# Altium schematic sheet POWER.SchDoc
size A2; SheetNumber: 2; SheetTotal: 8
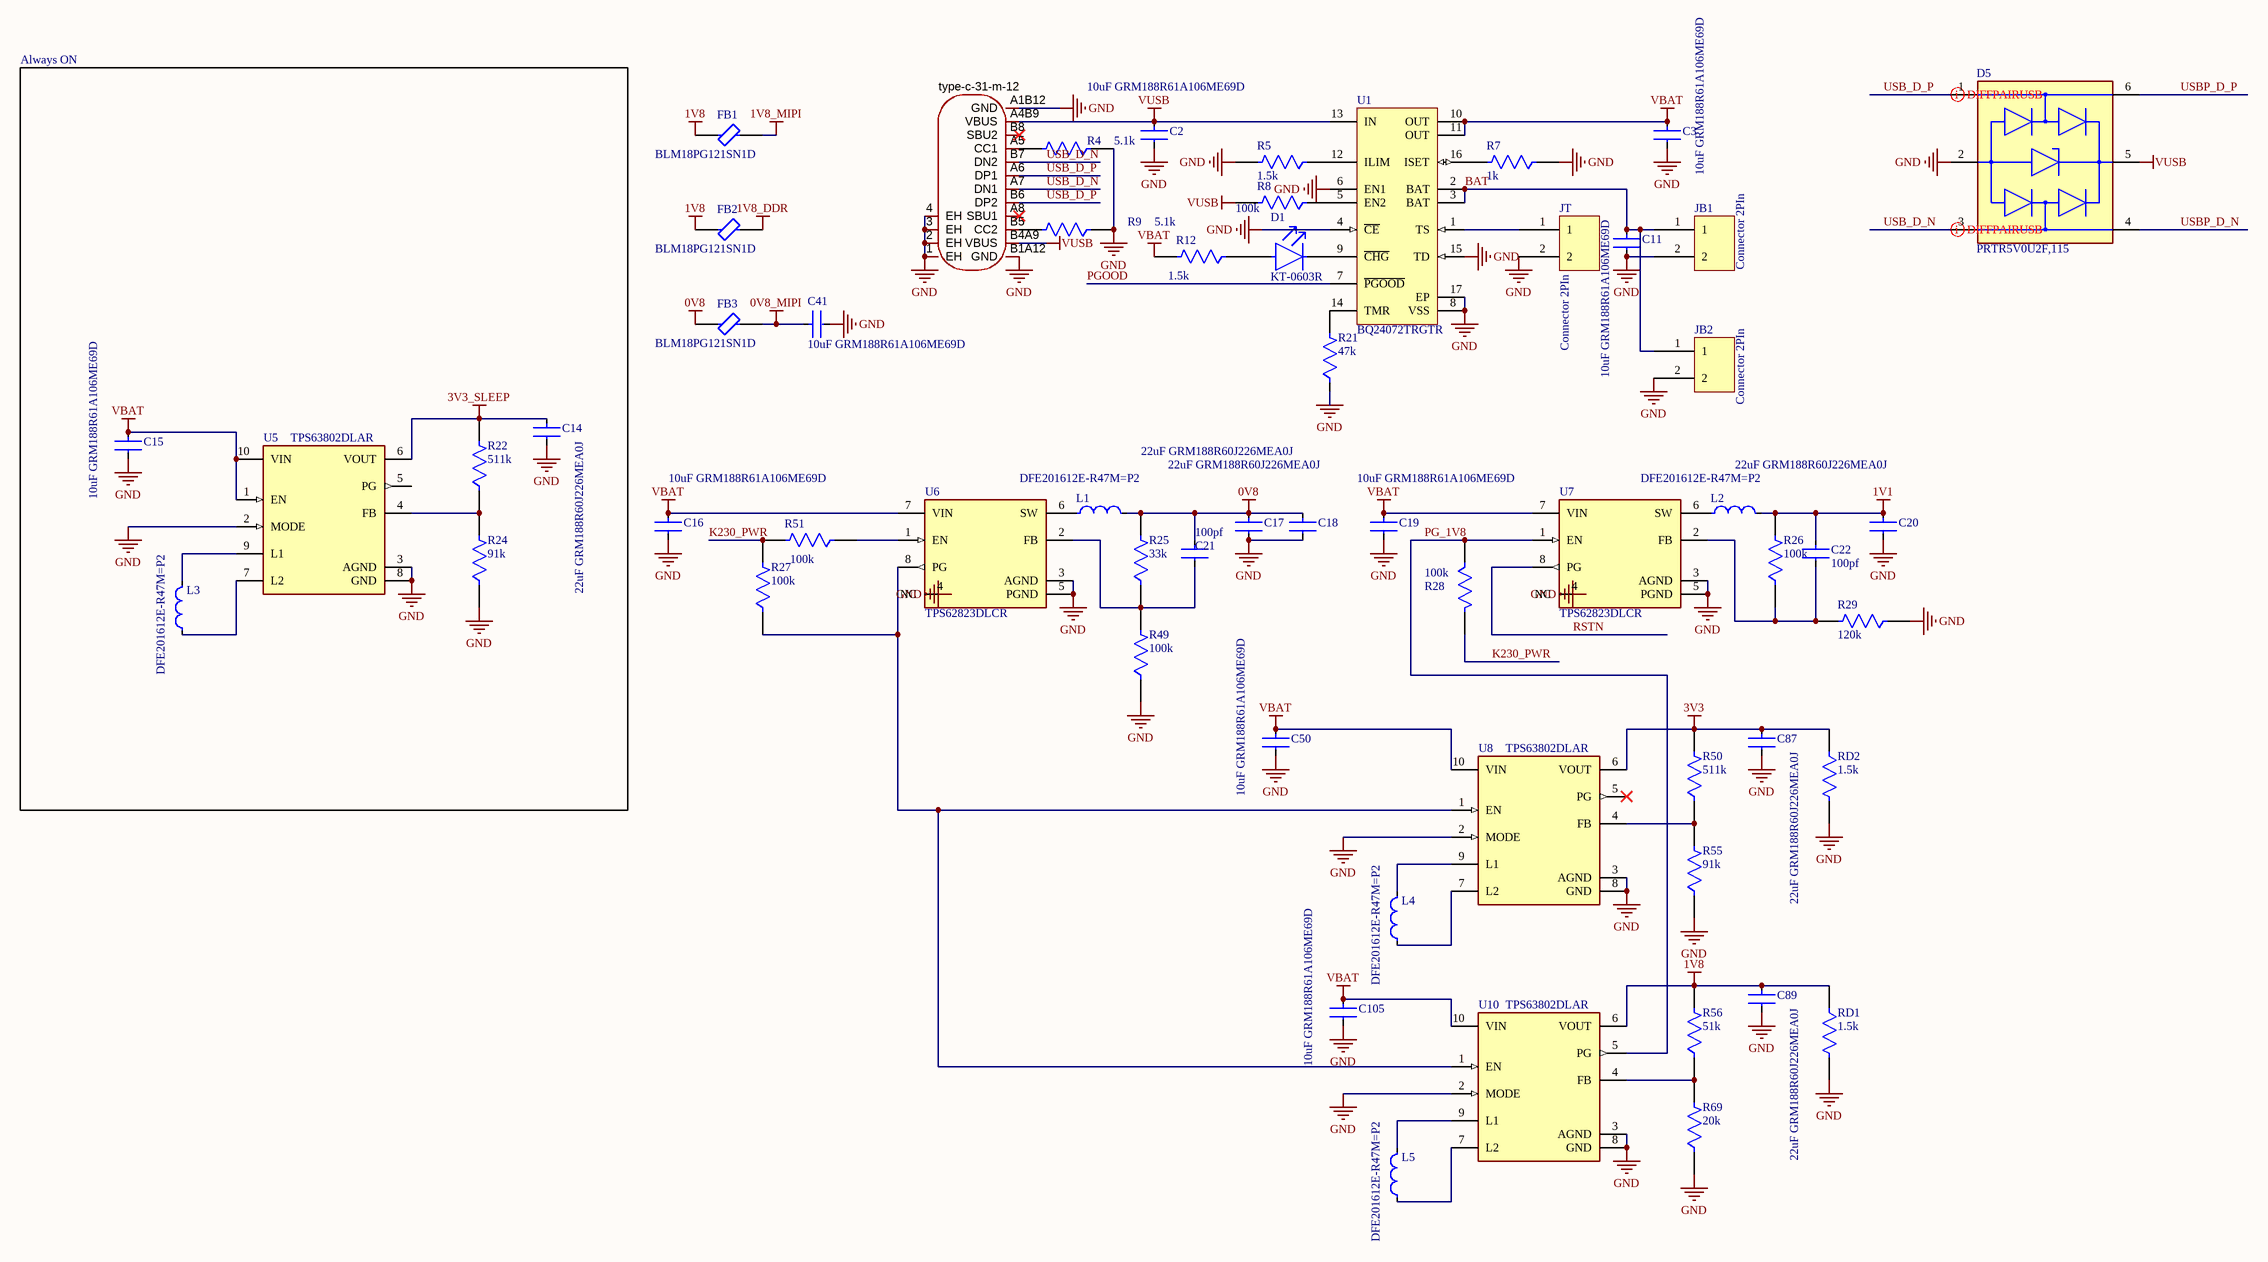
[diagram p0: POWER.SchDoc]

## Parts
C2  10uF GRM188R61A106ME69D  [FP-GRM188-0_15-MFG]
C3  10uF GRM188R61A106ME69D  [FP-GRM188-0_15-MFG]
C11  10uF GRM188R61A106ME69D  [FP-GRM188-0_15-MFG]
C14  22uF GRM188R60J226MEA0J  [FP-GRM188-0_2-IPC_C]
C15  10uF GRM188R61A106ME69D  [FP-GRM188-0_15-MFG]
C16  10uF GRM188R61A106ME69D  [FP-GRM188-0_15-MFG]
C17  22uF GRM188R60J226MEA0J  [FP-GRM188-0_2-IPC_C]
C18  22uF GRM188R60J226MEA0J  [FP-GRM188-0_2-IPC_C]
C19  10uF GRM188R61A106ME69D  [FP-GRM188-0_15-MFG]
C20  22uF GRM188R60J226MEA0J  [FP-GRM188-0_2-IPC_C]
C21  100pf  [CAP_0402]
C22  100pf  [CAP_0402]
C41  10uF GRM188R61A106ME69D  [FP-GRM188-0_15-MFG]
C50  10uF GRM188R61A106ME69D  [FP-GRM188-0_15-MFG]
C87  22uF GRM188R60J226MEA0J  [FP-GRM188-0_2-IPC_C]
C89  22uF GRM188R60J226MEA0J  [FP-GRM188-0_2-IPC_C]
C105  10uF GRM188R61A106ME69D  [FP-GRM188-0_15-MFG]
D1  KT-0603R  [FP-SML-LX0603IW-TR-MFG]
D5  PRTR5V0U2F,115  [FP-SOT886-MFG]
FB1  BLM18PG121SN1D  [FP-BLM18-0_15-t0_8-IPC_B]
FB2  BLM18PG121SN1D  [FP-BLM18-0_15-t0_8-IPC_B]
FB3  BLM18PG121SN1D  [FP-BLM18-0_15-t0_8-IPC_B]
JB1  Connector 2PIn  [CON_2P]
JB2  Connector 2PIn  [CON_2P]
JT  Connector 2PIn  [CON_2P]
L1  DFE201612E-R47M=P2  [FP-DFE201612C-IPC_C]
L2  DFE201612E-R47M=P2  [FP-DFE201612C-IPC_C]
L3  DFE201612E-R47M=P2  [FP-DFE201612C-IPC_C]
L4  DFE201612E-R47M=P2  [FP-DFE201612C-IPC_C]
L5  DFE201612E-R47M=P2  [FP-DFE201612C-IPC_C]
R4  5.1k  [RES_0402]
R5  1.5k  [RES_0402]
R7  1k  [RES_0402]
R8  100k  [RES_0402]
R9  5.1k  [RES_0402]
R12  1.5k  [RES_0402]
R21  47k  [RES_0402]
R22  511k  [RES_0402]
R24  91k  [RES_0402]
R25  33k  [RES_0402]
R26  100k  [RES_0402]
R27  100k  [RES_0402]
R28  100k  [RES_0402]
R29  120k  [RES_0402]
R49  100k  [RES_0402]
R50  511k  [RES_0402]
R51  100k  [RES_0402]
R55  91k  [RES_0402]
R56  51k  [RES_0402]
R69  20k  [RES_0402]
RD1  1.5k  [RES_0402]
RD2  1.5k  [RES_0402]
U1  BQ24072TRGTR  [RGT0016C_V]
U5  TPS63802DLAR  [FP-DLA0010A-MFG]
U6  TPS62823DLCR  [FP-DLC0008A-MFG]
U7  TPS62823DLCR  [FP-DLC0008A-MFG]
U8  TPS63802DLAR  [FP-DLA0010A-MFG]
U10  TPS63802DLAR  [FP-DLA0010A-MFG]
USBC1  type-c-31-m-12  [TYPE-C-31-M-12]

## Blocks framed on the sheet
Always ON: C14 C15 L3 R22 R24 U5

## Nets
0V8: C17.1 C18.1 C21.1 FB3.1 L1.2 R25.2
0V8_MIPI: C41.1 FB3.2
1V1: C20.1 C22.1 L2.2 R26.2
1V8: C89.1 FB1.1 FB2.1 R56.2 RD1.1 U10.6(VOUT)
1V8_DDR: FB2.2
1V8_MIPI: FB1.2
3V3: C87.1 R50.2 RD2.1 U8.6(VOUT)
3V3_SLEEP: C14.1 R22.2 U5.6(VOUT)
GND: C2.2 C3.2 C11.2 C14.2 C15.2 C16.2 C17.2 C18.2 C19.2 C20.2 C41.2 C50.2 C87.2 C89.2 C105.2 D5.2(GND) JB1.2 JB2.2 JT.2 R4.1 R5.2 R7.1 R9.1 R21.1 R24.1 R29.1 R49.1 R55.1 R69.1 RD1.2 RD2.2 U1.4(~{CE}) U1.6(EN1) U1.8(VSS) U1.15(TD) U1.17(EP) U5.2(MODE) U5.3(AGND) U5.8(GND) U6.3(AGND) U6.4(NC) U6.5(PGND) U7.3(AGND) U7.4(NC) U7.5(PGND) U8.2(MODE) U8.3(AGND) U8.8(GND) U10.2(MODE) U10.3(AGND) U10.8(GND) USBC1.1(EH) USBC1.2(EH) USBC1.3(EH) USBC1.4(EH) USBC1.A1B12(GND) USBC1.B1A12(GND)
VBAT: C3.1 C15.1 C16.1 C19.1 C50.1 C105.1 R12.2 U1.10(OUT) U1.11(OUT) U5.1(EN) U5.10(VIN) U6.7(VIN) U7.7(VIN) U8.10(VIN) U10.10(VIN)
VUSB: C2.1 D5.5(VCC) R8.2 U1.13(IN) USBC1.A4B9(VBUS) USBC1.B4A9(VBUS)
BAT: C11.1 JB1.1 JB2.1 U1.2(BAT) U1.3(BAT)
K230_PWR: R27.2 R28.2 R51.2
PG_1V8: R28.1 U7.1(EN) U10.5(PG)
PGOOD: U1.7(~{PGOOD})
RSTN: U7.8(PG)
USB_D_N: D5.3(I/O2) USBC1.A7(DN1) USBC1.B7(DN2)
USB_D_P: D5.1(I/O1) USBC1.A6(DP1) USBC1.B6(DP2)
USBP_D_N: D5.4(I/O2)
USBP_D_P: D5.6(I/O1)
NetC21_2: C21.2 R25.1 R49.2 U6.2(FB)
NetC22_2: C22.2 R26.1 R29.2 U7.2(FB)
NetD1_1: D1.1(C) U1.9(~{CHG})
NetD1_2: D1.2(A) R12.1
NetJT_1: JT.1 U1.1(TS)
NetL1_1: L1.1 U6.6(SW)
NetL2_1: L2.1 U7.6(SW)
NetL3_1: L3.1 U5.7(L2)
NetL3_2: L3.2 U5.9(L1)
NetL4_1: L4.1 U8.7(L2)
NetL4_2: L4.2 U8.9(L1)
NetL5_1: L5.1 U10.7(L2)
NetL5_2: L5.2 U10.9(L1)
NetR4_2: R4.2 USBC1.A5(CC1)
NetR5_1: R5.1 U1.12(ILIM)
NetR7_2: R7.2 U1.16(ISET)
NetR8_1: R8.1 U1.5(EN2)
NetR9_2: R9.2 USBC1.B5(CC2)
NetR21_2: R21.2 U1.14(TMR)
NetR22_1: R22.1 R24.2 U5.4(FB)
NetR27_1: R27.1 U6.8(PG) U8.1(EN) U10.1(EN)
NetR50_1: R50.1 R55.2 U8.4(FB)
NetR51_1: R51.1 U6.1(EN)
NetR56_1: R56.1 R69.2 U10.4(FB)

Not connected (* = marked no-connect by the designer): U5 5(PG); U8 5(PG)*; USBC1 A8(SBU1)* B8(SBU2)*

## Layout directives
differential pair; differential pair class USB: USB_D_N, USB_D_P

## Library data of the parts
C2 C3 C11 C15 C16 C19 C41 C50 C105 = CMP-06035-003612-1: C19702; Tolerance: 20%; Dielectric: X5R; Voltage Rating: 10V; Material: Ceramic; Package Quantity: 4000; Width: 0.8mm; Case/Package: 0603; Thickness: 0.035inch; Capacitance: 10uF; Voltage Rating (DC): 10V; Termination: SMD/SMT; Length: 1.6mm; Lead Free: Lead Free; Mount: Surface Mount; Height: 0.8mm; Depth: 0.8mm; Packaging: Tape and Reel; Weight: 0.000222oz; Min Operating Temperature: -55°C; Case Code (Metric): 1608; Max Operating Temperature: 85°C; Case Code (Imperial): 0603; Value: 10uF
C14 C17 C18 C20 C87 C89 = CMP-06035-027361-1: C59461; Dielectric: X5R; Voltage Rating: 6.3V; Tolerance: 20%; Capacitance: 22uF; Case Code (Metric): 1608; Thickness: 0.039inch; Termination: SMD/SMT; Voltage Rating (DC): 6.3V; Width: 0.031inch; Weight: 0.000222oz; Case/Package: 0603; Lead Free: Lead Free; Package Quantity: 10000; Case Code (Imperial): 0603; Length: 0.063inch; Packaging: Tape and Reel; Max Operating Temperature: 85°C; Min Operating Temperature: -55°C; Mount: Surface Mount; Value: 22uF
C21 C22 = CMP-03422-001116-1: C1546; Tolerance: 10%; Voltage Rating: 50V; Max Operating Temperature: 125°C; Case Code (Metric): 1005; RoHS Compliant: Yes; Series: -; Case Code (Imperial): 0402; Min Operating Temperature: -55°C; Mount: Surface Mount; Capacitance: 100pF; Case/Package: 0402; Packaging: Cut Tape; Value: 100pF
D1 = CMP-57192-000012-1: C2286; Luminous Intensity: 14mcd; Test Current: 20mA; Color: Red; Viewing Angle: 160°; Approvals: UL; Lens Style: Diffused; Forward Voltage: 2V; Power Dissipation: 50mW; Dominant Wavelength: 635nm; Number of LEDs: 1; Lens Color: White; Height: 0.6mm; RoHS Compliant: Yes; Lead Free: Lead Free; Number of Pins: 2; Packaging: Tape and Reel; Case/Package: 0603; Length: 1.6mm; Max Operating Temperature: 85°C; Illumination Color: Red; Case Code (Metric): 1608; Diameter: 0.061inch; Min Operating Temperature: -25°C; Mount: Surface Mount; Width: 0.8mm; Case Code (Imperial): 0603; Lens Transparency: Diffused; Wavelength: 635nm; Package Quantity: 1; Forward Current: 20mA
D5 = CMP-14436-000003-1: C478118; Manufacturer: Nexperia; Capacitance: 1pF; Reverse Standoff Voltage: 5.5V; Number Of Channels: 2; Automotive Grade: Grade 3; Direction: Unidirectional; Value: 1pF; Breakdown Voltage: 6V; Octopart: https://octopart.com/prtr5v0u2f%2C115-nexperia-78741690; Height: 0.5mm; Category: Diode; RoHS: TRUE; Automotive: Yes; Digikey Description: TVS DIODE 5.5V 6XSON SOT886; Device Class L1: Circuit Protection; Ambient Temperature Range High: +85°C; ComponentLink2Description: Datasheet; Manufacturer Part Number: PRTR5V0U2F,115; Device Class L3: unset; Footprint Url: https://assets.nexperia.com/documents/outline-drawing/SOT886.pdf; Lead Free: Yes; Ambient Temperature Range Low: -40°C; Device Class L2: TVS Diodes; Package: SOT886; ComponentLink2URL: https://assets.nexperia.com/documents/data-sheet/PRTR5V0U2F_PRTR5V0U2K.pdf
FB1-FB3 = CMP-0686-00439-3: C14709; DC Resistance (DCR): 180mR; Number of Lines: 1; Current Rating: 500mA; Material: Steel; Core Material: Ferrite; Impedance: 120R; Tolerance: 25%; Test Frequency: 100MHz; Shielding: Unshielded; Case/Package: 0603; Max Operating Temperature: 125°C; Min Operating Temperature: -55°C; Series: BLM18A; Case Code (Metric): 1608; DC Resistance-Max: 180mR; Package Quantity: 1; Radiation Hardening: No; Length: 1.6mm; Lead Free: Lead Free; Max DC Current: 500mA; Termination: SMD/SMT; Number of Pins: 2; Military Standard: Not; REACH SVHC: No SVHC; Number of Circuits: 1; Max Current Rating: 500mA; Depth: 0.8mm; Frequency: 100MHz; Width: 0.8mm; Case Code (Imperial): 0603; DC Current: 500mA; Height: 0.8mm; RoHS Compliant: Yes; Packaging: Tape and Reel
JB1 JB2 JT = CON2P
L1-L5 = CMP-06042-012656-1: C668312; Value: 0.47uH; Inductance: 0.47uH
R4 R9 = CMP-03412-016018-1: C25905; Tolerance: 1%; Temperature Coefficient: 100ppm/°C; Resistance: 5.1kOhm; Max Power Dissipation: 63mW; Value: 5.1kOhm; Ratings: AEC-Q200; Resistor Type: Thick Film; Number of Terminations: 2; RoHS Compliant: Yes; Min Operating Temperature: -55°C; Case/Package: 0402; Series: AC; Length: 0.039inch; Width: 0.02inch; Features: Moisture Resistant; Height: 0.015inch; Packaging: Tape and Reel; Max Operating Temperature: 155°C
R5 R12 RD1 RD2 = CMP-03412-016018-1: C25867; Tolerance: 1%; Temperature Coefficient: 100ppm/°C; Resistance: 1.5kOhm; Max Power Dissipation: 63mW; Value: 1.5kOhm; Ratings: AEC-Q200; Resistor Type: Thick Film; Number of Terminations: 2; RoHS Compliant: Yes; Min Operating Temperature: -55°C; Case/Package: 0402; Series: AC; Length: 0.039inch; Width: 0.02inch; Features: Moisture Resistant; Height: 0.015inch; Packaging: Tape and Reel; Max Operating Temperature: 155°C
R7 = CMP-03412-016018-1: C11702; Tolerance: 1%; Temperature Coefficient: 100ppm/°C; Resistance: 1kOhm; Max Power Dissipation: 63mW; Value: 1kOhm; Ratings: AEC-Q200; Resistor Type: Thick Film; Number of Terminations: 2; RoHS Compliant: Yes; Min Operating Temperature: -55°C; Case/Package: 0402; Series: AC; Length: 0.039inch; Width: 0.02inch; Features: Moisture Resistant; Height: 0.015inch; Packaging: Tape and Reel; Max Operating Temperature: 155°C
R8 R26-R28 R49 R51 = CMP-03412-016018-1: C25741; Tolerance: 1%; Temperature Coefficient: 100ppm/°C; Resistance: 100kOhm; Max Power Dissipation: 63mW; Value: 100kOhm; Ratings: AEC-Q200; Resistor Type: Thick Film; Number of Terminations: 2; RoHS Compliant: Yes; Min Operating Temperature: -55°C; Case/Package: 0402; Series: AC; Length: 0.039inch; Width: 0.02inch; Features: Moisture Resistant; Height: 0.015inch; Packaging: Tape and Reel; Max Operating Temperature: 155°C
R21 = CMP-03412-016018-1: C25792; Tolerance: 1%; Temperature Coefficient: 100ppm/°C; Resistance: 47kOhm; Max Power Dissipation: 63mW; Value: 47kOhm; Ratings: AEC-Q200; Resistor Type: Thick Film; Number of Terminations: 2; RoHS Compliant: Yes; Min Operating Temperature: -55°C; Case/Package: 0402; Series: AC; Length: 0.039inch; Width: 0.02inch; Features: Moisture Resistant; Height: 0.015inch; Packaging: Tape and Reel; Max Operating Temperature: 155°C
R22 R50 = CMP-03412-016018-1: C49655223; Tolerance: 1%; Temperature Coefficient: 100ppm/°C; Resistance: 511kOhm; Max Power Dissipation: 63mW; Value: 511kOhm; Ratings: AEC-Q200; Resistor Type: Thick Film; Number of Terminations: 2; RoHS Compliant: Yes; Min Operating Temperature: -55°C; Case/Package: 0402; Series: AC; Length: 0.039inch; Width: 0.02inch; Features: Moisture Resistant; Height: 0.015inch; Packaging: Tape and Reel; Max Operating Temperature: 155°C
R24 R55 = CMP-03412-016018-1: C54920709; Tolerance: 1%; Temperature Coefficient: 100ppm/°C; Resistance: 91kOhm; Max Power Dissipation: 63mW; Value: 91kOhm; Ratings: AEC-Q200; Resistor Type: Thick Film; Number of Terminations: 2; RoHS Compliant: Yes; Min Operating Temperature: -55°C; Case/Package: 0402; Series: AC; Length: 0.039inch; Width: 0.02inch; Features: Moisture Resistant; Height: 0.015inch; Packaging: Tape and Reel; Max Operating Temperature: 155°C
R25 = CMP-03412-016018-1: C25779; Tolerance: 1%; Temperature Coefficient: 100ppm/°C; Resistance: 33kOhm; Max Power Dissipation: 63mW; Value: 33kOhm; Ratings: AEC-Q200; Resistor Type: Thick Film; Number of Terminations: 2; RoHS Compliant: Yes; Min Operating Temperature: -55°C; Case/Package: 0402; Series: AC; Length: 0.039inch; Width: 0.02inch; Features: Moisture Resistant; Height: 0.015inch; Packaging: Tape and Reel; Max Operating Temperature: 155°C
R29 = CMP-03412-016018-1: C25750; Tolerance: 1%; Temperature Coefficient: 100ppm/°C; Resistance: 120kOhm; Max Power Dissipation: 63mW; Value: 120kOhm; Ratings: AEC-Q200; Resistor Type: Thick Film; Number of Terminations: 2; RoHS Compliant: Yes; Min Operating Temperature: -55°C; Case/Package: 0402; Series: AC; Length: 0.039inch; Width: 0.02inch; Features: Moisture Resistant; Height: 0.015inch; Packaging: Tape and Reel; Max Operating Temperature: 155°C
R56 = CMP-03412-016018-1: C25794; Tolerance: 1%; Temperature Coefficient: 100ppm/°C; Resistance: 51kOhm; Max Power Dissipation: 63mW; Value: 51kOhm; Ratings: AEC-Q200; Resistor Type: Thick Film; Number of Terminations: 2; RoHS Compliant: Yes; Min Operating Temperature: -55°C; Case/Package: 0402; Series: AC; Length: 0.039inch; Width: 0.02inch; Features: Moisture Resistant; Height: 0.015inch; Packaging: Tape and Reel; Max Operating Temperature: 155°C
R69 = CMP-03412-016018-1: C25765; Tolerance: 1%; Temperature Coefficient: 100ppm/°C; Resistance: 20kOhm; Max Power Dissipation: 63mW; Value: 20kOhm; Ratings: AEC-Q200; Resistor Type: Thick Film; Number of Terminations: 2; RoHS Compliant: Yes; Min Operating Temperature: -55°C; Case/Package: 0402; Series: AC; Length: 0.039inch; Width: 0.02inch; Features: Moisture Resistant; Height: 0.015inch; Packaging: Tape and Reel; Max Operating Temperature: 155°C
U1 = CMP-0321-00268-2: C129319; Manufacturer: Texas Instruments; Eco-Plan: Green (RoHS & no Sb/Br); Over Voltage Protection: N; Li-Ion: Y; SubFamily: Battery Charge Management; Vin(Min)(V): 4.3; Code_JEDEC: MO-220; ComponentLink1Description: Datasheet; Mounting Technology: Surface Mount; PartNumber: BQ24072TRGTR; Lead Acid: N; Li-Polymer: Y; NiMH: N; DatasheetVersion: SLUS937A; NiCd: N; ComponentLink1URL: http://www.ti.com/general/docs/lit/getliterature.tsp?genericPartNumber=BQ24072T&fileType=pdf; PackageDescription: 16-Pin Plastic Quad Flat No-Lead, 3 x 3 mm Body, 0.5 mm Pitch, 1.7 x 1.7 mm Exposed Pad; PackageReference: RGT0016C; PackageVersion: revH, Oct-2011
U5 U8 U10 = CMP-04918-000005-1: C2845237; Manufacturer: Texas Instruments; Nominal Supply Current: 11uA; Max Junction Temp: +125°C; Max Supply Voltage: 5.5V; Switching Topology: Buck-Boost; Min Supply Voltage: 1.3V; Output Current: 2A; Output Voltage: 1.8-5.2V; Number Of Outputs: 1; Switching Frequency: 1.4/1.6/2.1MHz; Standoff Height: 0mm; Max Duty Cycle: 100%; Output Type: AdjustableProgrammable; Manufacturer Part Number: TPS63802DLAR; ComponentLink2URL: https://www.ti.com/lit/ds/symlink/tps63802.pdf; Digikey Description: IC POWER MANAGEMENT; Octopart: https://octopart.com/tps63802dlar-texas+instruments-97359678; Height: 1mm; Temperature: -40°C to +125°C; Device Class L3: Voltage Regulators - Switching; Lead Free: Yes; Category: IC; Mouser Description: 2-A, high-efficient, 11-µA quiescent current buck-boost converter in QFN/DFN package 10-VSON-HR -40 to 125; ComponentLink2Description: Datasheet; Temperature Range Low: -40°C; Temperature Range High: +125°C; Automotive: No; Device Class L2: Power Management ICs; RoHS: TRUE; Device Class L1: Integrated Circuits (ICs); Package: DLA0010A
U6 U7 = CMP-04918-000715-1: C2693497; Output Configuration: Positive; Max Input Voltage: 5.5V; Number of Outputs: 1; Min Output Voltage: 600mV; Output Type: Adjustable; Max Output Voltage: 4V; Switching Frequency: 2.2MHz; Min Input Voltage: 2.4V; Synchronous Rectifier: Yes; Output Current: 3A; Min Operating Temperature: -40°C; Series: -; RoHS Compliant: Yes; Mount: Surface Mount; Number of Pins: 8; Packaging: Cut Tape; Max Operating Temperature: 125°C
USBC1 = type-c-31-m-12: C165948; Manufacturer: 韩国韩荣; AddInBom: yes; ModelId: 8421221a464047838322348b3a9debc3; ModelName: USB-C_SMD-TYPE-C-31-M-12_1; ModelTransform: 351.9678,311.023,0,180,0,0,0,-43.307,-33.465; Connector Type: Type-C; Gender: Female; Number of Contacts: 16P; Number of Ports: 1; Current Rating-Power: 5A; Voltage Rating: 20V; Connect-Disconnect Life: 10,000 cycles; Symbol: TYPE-C-31-M-12; LCSC Part Name: Type-C 母 卧贴; SupplierPart: C165948; ManufacturerPart: TYPE-C-31-M-12; Supplier Footprint: SMD; JLCPCB Part Class: Extended Part; Datasheet: https://item.szlcsc.com/datasheet/TYPE-C-31-M-12/177331.html; Supplier: LCSC; ConvertToPcb: yes; FootprintName: USB-C_SMD-TYPE-C-31-M-12_1; Protocol Standard: -; Mounting Type: Surface Mount, Right Angle; Length: 7.35mm; Operating Temperature: -30℃~+80℃